# EAGLE schematic opemGBZ (EAGLE 9.1.0)
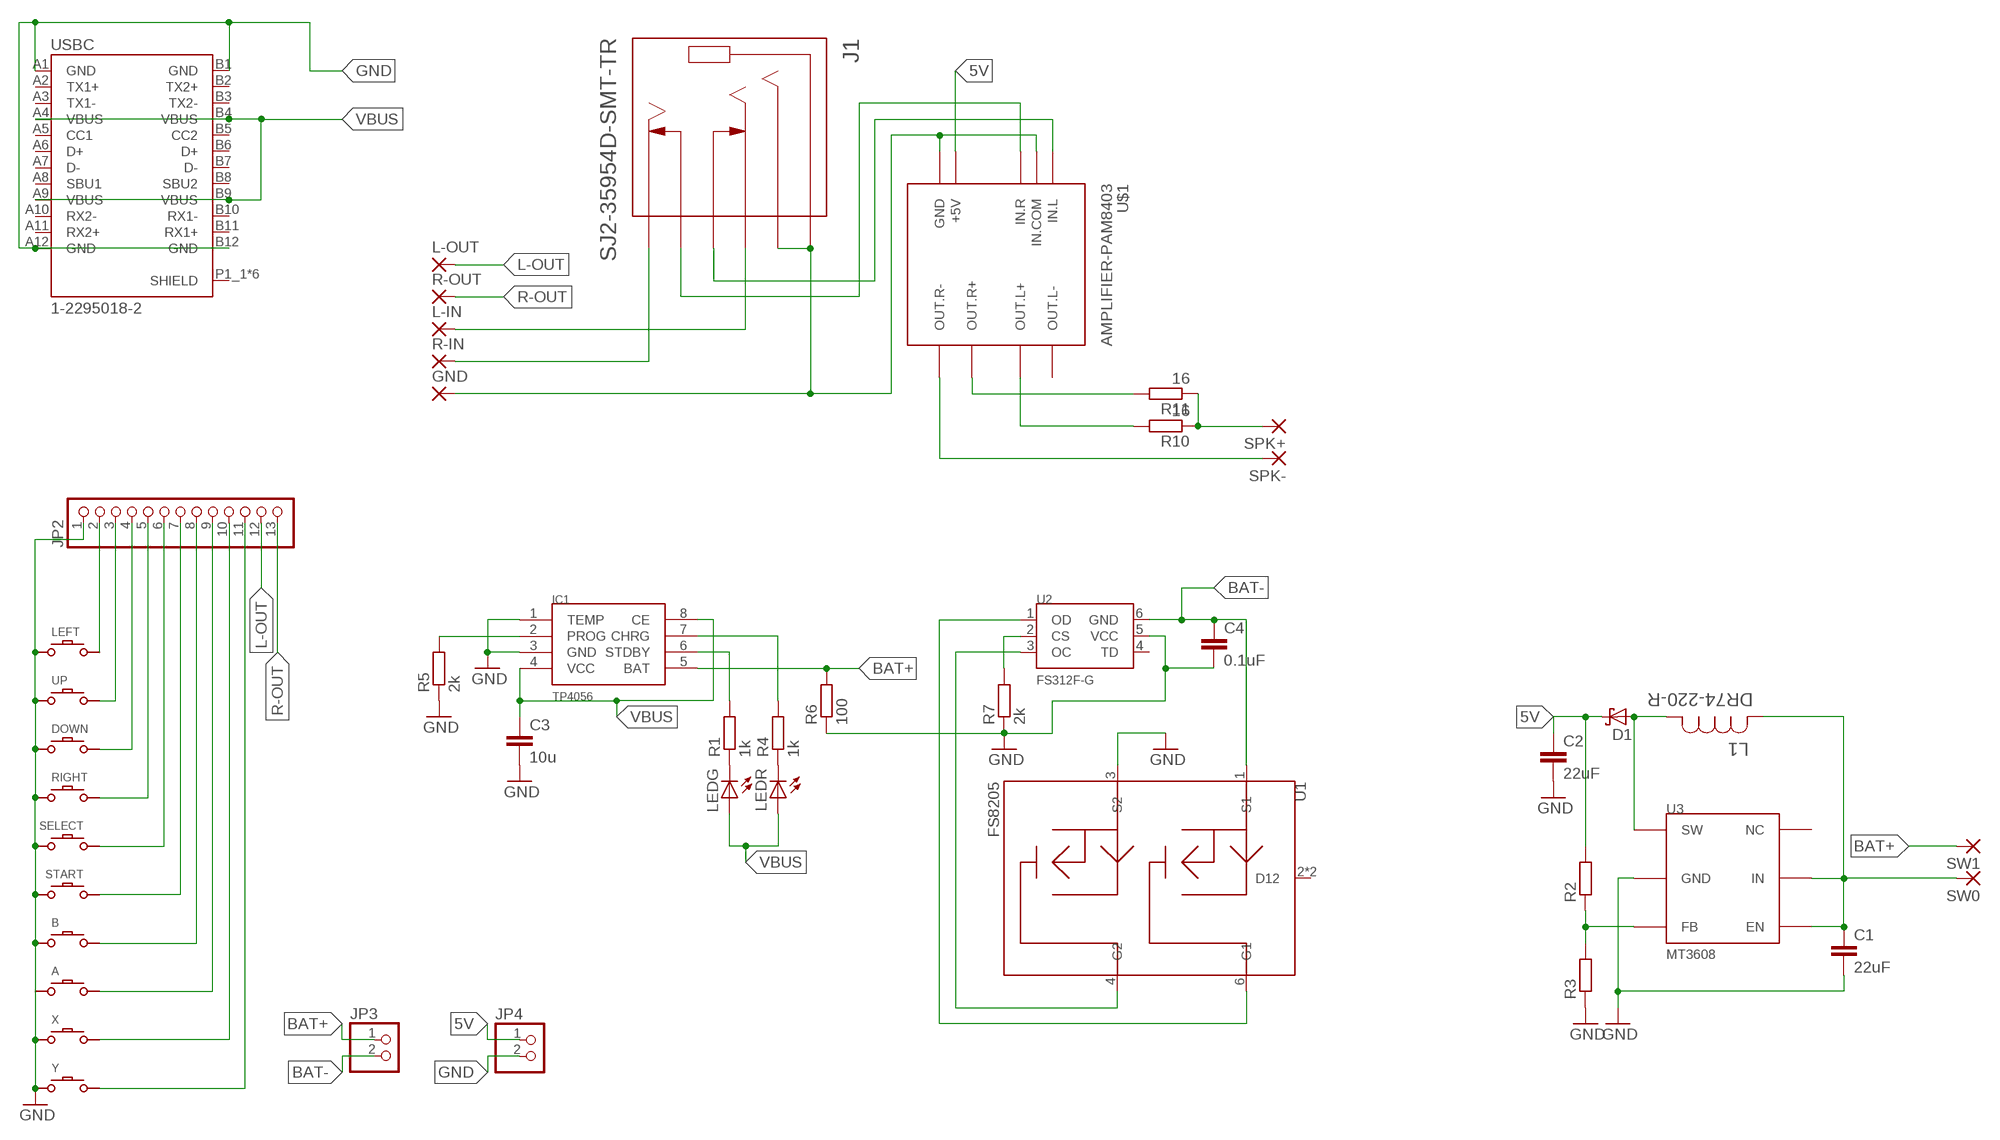
[diagram p0: schematic, sheet 1]

## Parts
A  DMG-BTN  DMG-BTNREGULAR  [DMG-BTN]
B  DMG-BTN  DMG-BTNREGULAR  [DMG-BTN]
C1  22uF  C-EUC1812  [C1812]
C2  22uF  C-EUC1812  [C1812]
C3  10u  C-EUC0603  [C0603]
C4  0.1uF  C-EUC0603  [C0603]
D1  SCHOTTKY-DIODESMD  [SMB]
DOWN  DMG-BTN  DMG-BTNREGULAR  [DMG-BTN]
GND  WIREPADSMD1,27-254  [SMD1,27-2,54]
IC1  TP4056  [SOP-8]
J1  SJ2-35954D-SMT-TR  [CUI_SJ2-35954D-SMT-TR]
JP2  PINHD-1X13  [1X13]
JP3  PINHD-1X2  [1X02]
JP4  PINHD-1X2  [1X02]
L1  DR74-220-R  [INDM7676X435N]
L-IN  WIREPADSMD1,27-254  [SMD1,27-2,54]
L-OUT  WIREPADSMD1,27-254  [SMD1,27-2,54]
LEDG  LEDCHIP-LED0603  [CHIP-LED0603]
LEDR  LEDCHIP-LED0603  [CHIP-LED0603]
LEFT  DMG-BTN  DMG-BTNREGULAR  [DMG-BTN]
R1  1k  R-EU_R0603  [R0603]
R2  R-EU_R0603  [R0603]
R3  R-EU_R0603  [R0603]
R4  1k  R-EU_R0603  [R0603]
R5  2k  R-EU_R0603  [R0603]
R6  100  R-EU_R0603  [R0603]
R7  2k  R-EU_R0603  [R0603]
R10  16  R-EU_R0603  [R0603]
R11  16  R-EU_R0603  [R0603]
R-IN  WIREPADSMD1,27-254  [SMD1,27-2,54]
R-OUT  WIREPADSMD1,27-254  [SMD1,27-2,54]
RIGHT  DMG-BTN  DMG-BTNREGULAR  [DMG-BTN]
SELECT  DMG-BTN  DMG-BTNSELECT  [DMG-SEL]
SPK+  WIREPADSMD1,27-254  [SMD1,27-2,54]
SPK-  WIREPADSMD1,27-254  [SMD1,27-2,54]
START  DMG-BTN  DMG-BTNSELECT  [DMG-SEL]
SW0  WIREPADSMD1,27-254  [SMD1,27-2,54]
SW1  WIREPADSMD1,27-254  [SMD1,27-2,54]
U1  FS8205  [SOT23-6]
U2  FS312F-G  [SOT23-6]
U3  MT3608  [SOT23-6]
U$1  AMPLIFIER-PAM8403  [AMPLIFIER-PAM8403]
UP  DMG-BTN  DMG-BTNREGULAR  [DMG-BTN]
USBC  1-2295018-2  [TE_1-2295018-2]
X  DMG-BTN  DMG-BTNREGULAR  [DMG-BTN]
Y  DMG-BTN  DMG-BTNREGULAR  [DMG-BTN]

## Nets
5V: C2.1 D1.C JP4.1 R2.2 U$1.+5V
BAT+: C1.1 IC1.5(BAT) L1.2 R6.2 SW1.1(P) U3.4(EN) U3.5(IN)
BAT-: C4.1 U1.1(S1) U2.6(GND)
GND: A.P$1 B.P$1 C1.2 C2.2 C3.2 C4.2 DOWN.P$1 IC1.1(TEMP) IC1.3(GND) JP2.1 JP4.2 LEFT.P$1 R3.1 R5.1 R6.1 R7.1 RIGHT.P$1 SELECT.P$2 START.P$2 U1.3(S2) U2.5(VCC) U3.2(GND) UP.P$1 USBC.A1(GND) USBC.A12(GND) USBC.B1(GND) USBC.B12(GND) X.P$1 Y.P$1
L-OUT: JP2.12 L-OUT.1(P)
L-OUT1: SW0.1(P)
N$1: JP2.2 LEFT.P$2
N$2: JP2.3 UP.P$2
N$3: DOWN.P$2 JP2.4
N$4: JP2.5 RIGHT.P$2
N$5: JP2.6 SELECT.P$1
N$6: JP2.7 START.P$1
N$7: B.P$2 JP2.8
N$8: A.P$2 JP2.9
N$9: JP2.10 X.P$2
N$10: JP2.11 Y.P$2
N$11: IC1.6(STDBY) R1.2
N$12: IC1.7(CHRG) R4.2
N$13: LEDG.C R1.1
N$14: LEDR.C R4.1
N$15: IC1.2(PROG) R5.2
N$16: U1.4(G2) U2.3(OC)
N$17: U1.6(G1) U2.1(OD)
N$18: R7.2 U2.2(CS)
N$19: D1.A L1.1 U3.1(SW)
N$20: R2.1 R3.2 U3.3(FB)
N$21: R11.2 U$1.OUT.R+
N$22: GND.1(P) J1.1(SLEEVE) J1.4(RING2) U$1.GND U$1.IN.COM
N$23: J1.11(RING1_SWITCH) U$1.IN.L
N$24: J1.10(TIP_SWITCH) U$1.IN.R
N$25: J1.2(TIP) R-IN.1(P)
N$26: J1.3(RING1) L-IN.1(P)
N$27: R10.2 U$1.OUT.L+
N$28: R10.1 R11.1 SPK+.1(P)
N$29: SPK-.1(P) U$1.OUT.R-
R-OUT: JP2.13 R-OUT.1(P)
VBUS: C3.1 IC1.4(VCC) IC1.8(CE) LEDG.A LEDR.A USBC.A4(VBUS) USBC.A9(VBUS) USBC.B4(VBUS) USBC.B9(VBUS)
Unconnected: JP3.1 JP3.2 U1.2(D12) U1.5(D12) U2.4(TD) U3.6(NC) U$1.OUT.L- USBC.A2(TX1+) USBC.A3(TX1-) USBC.A5(CC1) USBC.A6(D+) USBC.A7(D-) USBC.A8(SBU1) USBC.A10(RX2-) USBC.A11(RX2+) USBC.B2(TX2+) USBC.B3(TX2-) USBC.B5(CC2) USBC.B6(D+) USBC.B7(D-) USBC.B8(SBU2) USBC.B10(RX1-) USBC.B11(RX1+) USBC.P1_1(SHIELD) USBC.P1_2(SHIELD) USBC.P2_1(SHIELD) USBC.P2_2(SHIELD) USBC.P4(SHIELD) USBC.P5(SHIELD)

## Library data of the parts
A B DOWN LEFT RIGHT SELECT START UP X Y = Game Boy:DMG-BTN
C1-C4 = rcl:C-EU: CAPACITOR, European symbol; SPICEPREFIX: C
D1 = diode:SCHOTTKY-DIODE: Schottky Diode
GND L-IN L-OUT R-IN R-OUT SPK+ SPK- SW0 SW1 = wirepad:WIREPAD: Wire PAD connect wire on PCB
IC1 = TP4056:TP4056
J1 = SJ2-35954D-SMT-TR:SJ2-35954D-SMT-TR: 4 conductors, 3.5mm, SMT Audio Jack w/ 2 Switch; AVAILABILITY: Good; DESCRIPTION: 4 conductors, 3.5mm, SMT Audio Jack w/ 2 Switch; MF: CUI; MP: SJ2-35954D-SMT-TR; PACKAGE: None; PRICE: 0.94 USD
JP2 = pinhead:PINHD-1X13: PIN HEADER
JP3 JP4 = pinhead:PINHD-1X2: PIN HEADER
L1 = DR74-220-R:DR74-220-R: POWER INDUCTOR; AVAILABILITY: Good; DESCRIPTION: Inductor Power Shielded Drum Core 21.73uH/22uH 20% 100KHz Ferrite 1.75A 92.5mOhm DCR T/R; MF: Eaton; MP: DR74-220-R; PACKAGE: Nonstandard Eaton; PRICE: 0.98 USD
LEDG LEDR = led:LED: LED OSRAM: - CHIPLED LG R971, LG N971, LY N971, LG Q971, LY Q971, LO R971, LY R971 LH N974, LH R974 LS Q976, LO Q976, LY Q976 LO Q996 - Hyper CHIPLED LW Q18S LB Q993, LB Q99A, LB R99A - SideLED LS A670, LO A670, LY A670, LG A670, LP A670 LB A673, LV A673, LT A673, LW A673 LH A674 LY A675 LS A676, LA A676, LO A676, LY A676, LW A676 LS A679, LY A679, LG A679 - Hyper Micro SIDELED® LS Y876, LA Y876, LO Y876, LY Y876 LT Y87S - SmartLED LW L88C, LW L88S LB L89C, LB L89S, LG L890 LS L89K, LO L89K, LY L89K LS L896, LA L896, LO L896, LY L896 - TOPLED LS T670, LO T670, LY T670, LG T670, LP T670 LSG T670, LSP T670, LSY T670, LOP T670, LYG T670 LG T671, LOG T671, LSG T671 LB T673, LV T673, LT T673, LW T673 LH T674 LS T676, LA T676, LO T676, LY T676, LB T676, LH T676, LSB T676, LW T676 LB T67C, LV T67C, LT T67C, LS T67K, LO T67K, LY T67K, LW E67C LS E67B, LA E67B, LO E67B, LY E67B, LB E67C, LV E67C, LT E67C LW T67C LS T679, LY T679, LG T679 LS T770, LO T770, LY T770, LG T770, LP T770 LB T773, LV T773, LT T773, LW T773 LH T774 LS E675, LA E675, LY E675, LS T675 LS T776, LA T776, LO T776, LY T776, LB T776 LHGB T686 LT T68C, LB T68C - Hyper Mini TOPLED® LB M676 - Mini TOPLED Santana® LG M470 LS M47K, LO M47K, LY M47K Source: http://www.osram.convergy.de LUXEON: - LUMILED® LXK2-PW12-R00, LXK2-PW12-S00, LXK2-PW14-U00, LXK2-PW14-V00 LXK2-PM12-R00, LXK2-PM12-S00, LXK2-PM14-U00 LXK2-PE12-Q00, LXK2-PE12-R00, LXK2-PE12-S00, LXK2-PE14-T00, LXK2-PE14-U00 LXK2-PB12-K00, LXK2-PB12-L00, LXK2-PB12-M00, LXK2-PB14-N00, LXK2-PB14-P00, LXK2-PB14-Q00 LXK2-PR12-L00, LXK2-PR12-M00, LXK2-PR14-Q00, LXK2-PR14-R00 LXK2-PD12-Q00, LXK2-PD12-R00, LXK2-PD12-S00 LXK2-PH12-R00, LXK2-PH12-S00 LXK2-PL12-P00, LXK2-PL12-Q00, LXK2-PL12-R00 Source: www.luxeon.com KINGBRIGHT: KA-3528ASYC Source: www.kingbright.com
R1-R7 R10 R11 = rcl:R-EU_: RESISTOR, European symbol; SPICEPREFIX: R
U1 = fs8205:FS8205
U2 = fs321f-g:FS312F-G
U3 = mt3608:MT3608
U$1 = diy-modules:AMPLIFIER-PAM8403: Stereo Class-D 3W Audio Amplifier based on PAM8403 chip More details available here: http://artofcircuits.com/product/pam8403-5v-two-channel-stereo-mini-class-d-3w3w-audio-amplifier Click here to find device on ebay.com <http://www.ebay.com/sch/pam8403+mini+class+d>
USBC = 1-2295018-2:1-2295018-2: SPLASH PROOF USB TYPE C REC, DUAL SMT; Tape/Reel of 900; AVAILABILITY: Good; CENTERLINE_PITCH: .5 mm[.019 in]; COMMENT: 1-2295018-2; DESCRIPTION: USB TYPE C, REC OFFSET 0.65MM DUAL SMT; MF: TE Connectivity; MP: 1-2295018-2; NUMBER_OF_POSITIONS: 24; PACKAGE: None; PRICE: 1.82 USD; PRODUCT_TYPE: Connector